# Altium schematic sheet FPGA.SCHDOC: FPGA Connections
size A2; Organization: Altium Limited.; Address1: Level 3, 12a Rodborough Rd; Address2: Frenchs Forest 2086; Address3: NSW; Address4: AUSTRALIA; DocumentNumber: 3; SheetNumber: 4; SheetTotal: 23; PageSetup: Record=PageOptions|CenterHorizontal=True|CenterVertical=True|PrintScale=0.71|XCorrection=1.00|YCorrection=1.00|PrintKind=0|BorderSize=5000000|LeftOffset=0|BottomOffset=0|Orientation=2|PaperLength=4199|PaperWidth=2969|Scale=100|PaperSource=7|PrintQuality=600|MediaType=1|DitherType=10|PaperKind=A3 (297 x 420 mm)|PrintScaleMode=1
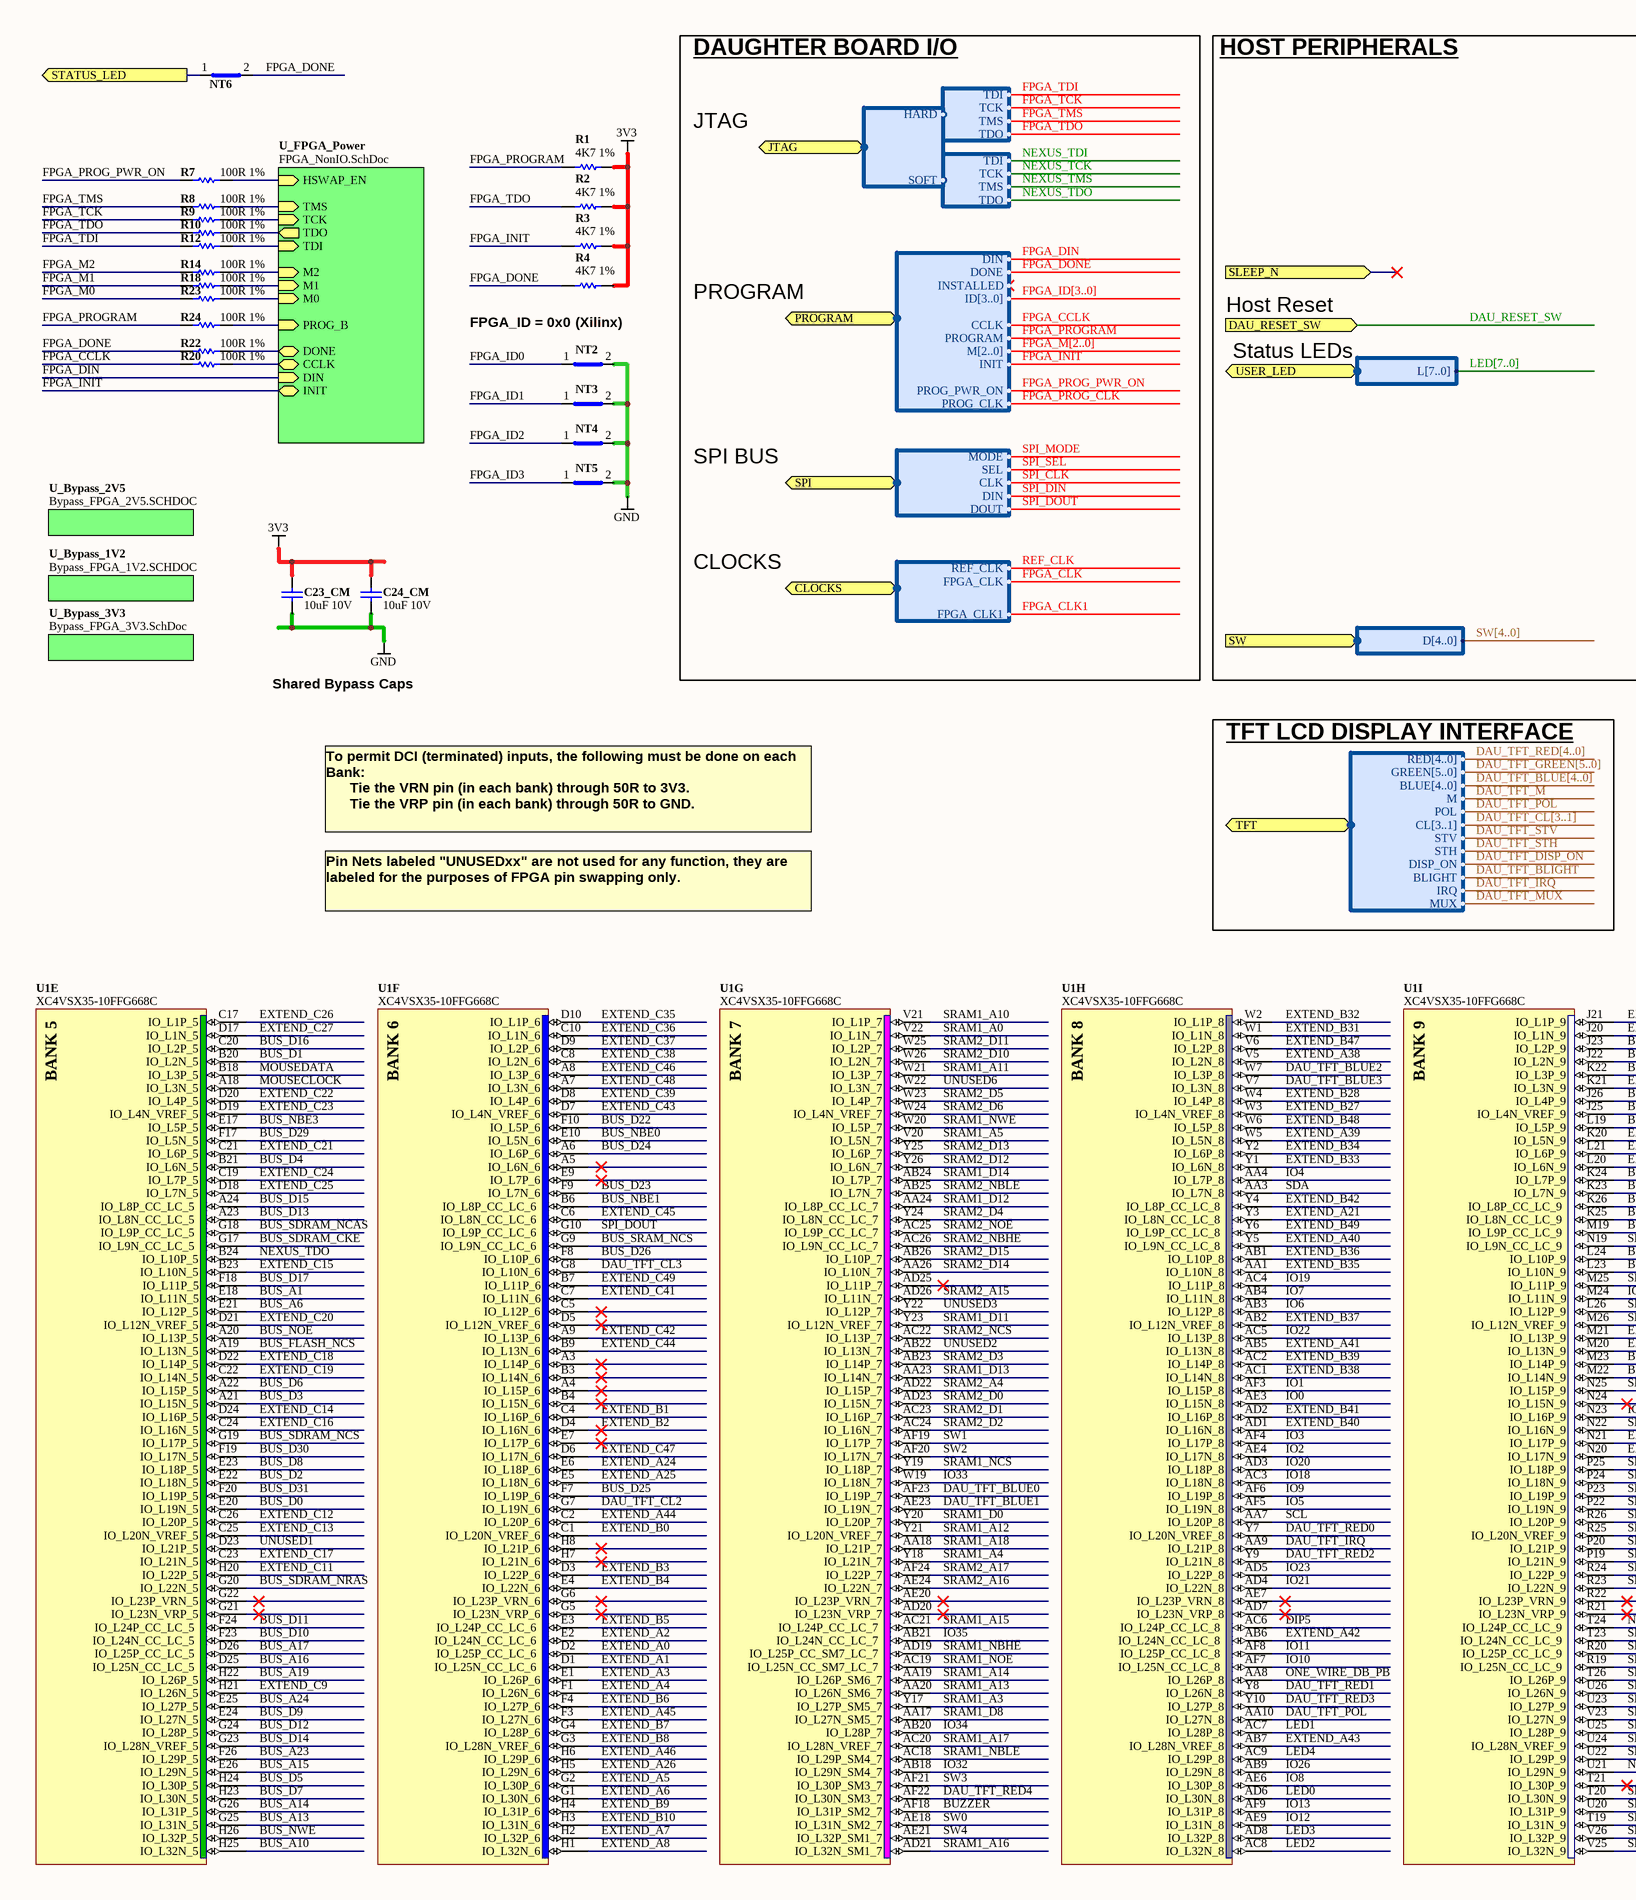
[diagram p0: FPGA.SCHDOC, left]
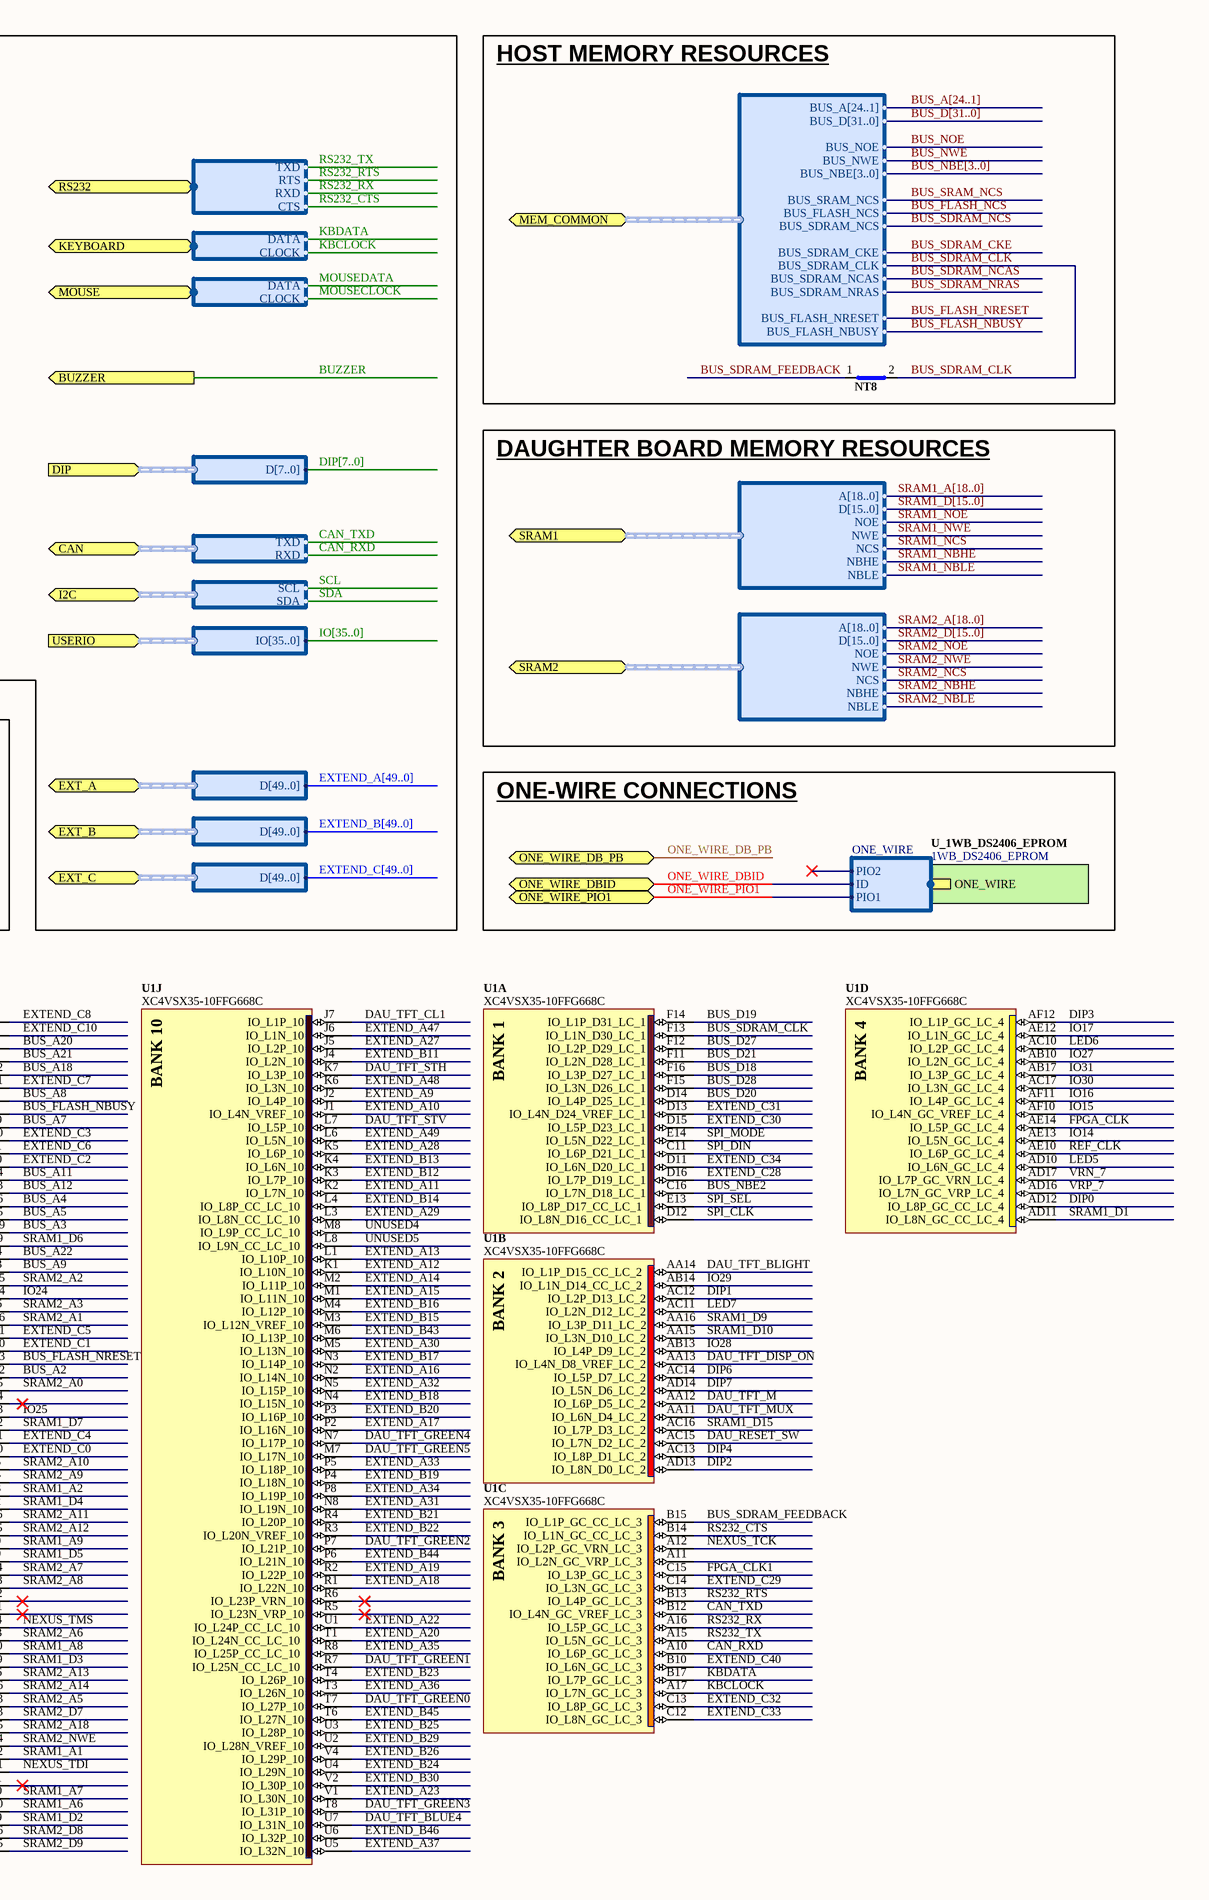
[diagram p1: FPGA.SCHDOC, right]

## Parts
C23_CM  10uF 10V  [CAPC2012-STAR]
C24_CM  10uF 10V  [CAPC2012-STAR]
NT2  Net Tie SMT2  [NETTIE-SMT2-8X8]  (value not drawn)  (net tie, no BOM)
NT3  Net Tie SMT2  [NETTIE-SMT2-8X8]  (value not drawn)  (net tie, no BOM)
NT4  Net Tie SMT2  [NETTIE-SMT2-8X8]  (value not drawn)  (net tie, no BOM)
NT5  Net Tie SMT2  [NETTIE-SMT2-8X8]  (value not drawn)  (net tie, no BOM)
NT6  Net Tie SMT2  [NETTIE-SMT2-8X8]  (value not drawn)  (net tie, no BOM)
NT8  Net Tie SMT2  [NETTIE-SMT2-8X8]  (value not drawn)  (net tie, no BOM)
R1  4K7 1%  [RESC1005-STAR]
R2  4K7 1%  [RESC1005-STAR]
R3  4K7 1%  [RESC1005-STAR]
R4  4K7 1%  [RESC1005-STAR]
R7  100R 1%  [RESC1005-STAR]
R8  100R 1%  [RESC1005-STAR]
R9  100R 1%  [RESC1005-STAR]
R10  100R 1%  [RESC1005-STAR]
R12  100R 1%  [RESC1005-STAR]
R14  100R 1%  [RESC1005-STAR]
R18  100R 1%  [RESC1005-STAR]
R20  100R 1%  [RESC1005-STAR]
R22  100R 1%  [RESC1005-STAR]
R23  100R 1%  [RESC1005-STAR]
R24  100R 1%  [RESC1005-STAR]
U1  XC4VSX35-10FFG668C  [XC4VLX25-10FF668C]  (parts A,B,C,D,E,F,G,H,I,J of 14)

## Blocks framed on the sheet
HOST MEMORY RESOURCES: NT8

## Sub-sheets
U_1WB_DS2406_EPROM = 1WB_DS2406_EPROM: ONE_WIRE (harness ONE_WIRE)
U_Bypass_1V2 = Bypass_FPGA_1V2.SCHDOC: no entries
U_Bypass_2V5 = Bypass_FPGA_2V5.SCHDOC: no entries
U_Bypass_3V3 = Bypass_FPGA_3V3.SchDoc: no entries
U_FPGA_Power = FPGA_NonIO.SchDoc: TMS (in), DONE (bidir), M1 (in), CCLK (bidir), M0 (in), M2 (in), TCK (in), HSWAP_EN (in), TDI (in), PROG_B (in), TDO (out), DIN (in), INIT (bidir)

## Ports
BUZZER (out), CAN (harness CAN_INT), CLOCKS (harness DAU_CLK), DAU_RESET_SW (in), DIP (harness SW8), EXT_A (harness PBIO), EXT_B (harness PBIO), EXT_C (harness PBIO), I2C (harness I2C), JTAG (harness HARDSOFT_JTAG), KEYBOARD (harness PS2), MEM_COMMON (harness HOSTMEMORY), MOUSE (harness PS2), ONE_WIRE_DB_PB (bidir), ONE_WIRE_DBID (bidir), ONE_WIRE_PIO1 (bidir), PROGRAM (harness DAU_CTRL), RS232 (harness RS232_INT), SLEEP_N (in), SPI (harness DAU_SPI), SRAM1 (harness SRAM-256Kx16), SRAM2 (harness SRAM-256Kx16), STATUS_LED (out), SW (harness SW5), TFT (harness DAU_TFT), USER_LED (harness LED8), USERIO (harness IO36)

## Harnesses
ONE_WIRE: ID, PIO1, PIO2
SRAM-256Kx16: A[18..0], D[15..0], NCS, NWE, NOE, NBHE, NBLE
HOSTMEMORY: BUS_A[24..1], BUS_D[31..0], BUS_NOE, BUS_NWE, BUS_NBE[3..0], BUS_SRAM_NCS, BUS_FLASH_NCS, BUS_SDRAM_NCS, BUS_SDRAM_CKE, BUS_SDRAM_CLK, BUS_SDRAM_NCAS, BUS_SDRAM_NRAS, BUS_FLASH_NRESET, BUS_FLASH_NBUSY
DAU_CLK: REF_CLK, FPGA_CLK, FPGA_CLK1
DAU_SPI: MODE, SEL, CLK, DIN, DOUT
DAU_CTRL: DIN, DONE, INSTALLED, ID[3..0], CCLK, PROGRAM, M[2..0], INIT, PROG_PWR_ON, PROG_CLK
JTAG: TMS, TDO, TDI, TCK
HARDSOFT_JTAG: HARD, SOFT
LED8: L[7..0]
SW5: D[4..0]
DAU_TFT: RED[4..0], GREEN[5..0], BLUE[4..0], M, POL, CL[3..1], STV, STH, DISP_ON, BLIGHT, IRQ, MUX
PS2: DATA, CLOCK
RS232_INT: RXD, TXD, RTS, CTS
IO36: IO[35..0]
SW8: D[7..0]
CAN_INT: TXD, RXD
I2C: SCL, SDA
PBIO: D[49..0]

## Nets
3V3: C23_CM.1 C24_CM.1 R1.2 R2.2 R3.2 R4.2
GND: C23_CM.2 C24_CM.2 NT2.2(Net2) NT3.2(Net2) NT4.2(Net2) NT5.2(Net2)
BUS_A1: U1.E18(IO_L11N_5)
BUS_A2: U1.M22(IO_L14N_9)
BUS_A3: U1.M19(IO_L9P_CC_LC_9)
BUS_A4: U1.K26(IO_L8P_CC_LC_9)
BUS_A5: U1.K25(IO_L8N_CC_LC_9)
BUS_A6: U1.E21(IO_L12P_5)
BUS_A7: U1.L19(IO_L5P_9)
BUS_A8: U1.J26(IO_L4P_9)
BUS_A9: U1.L23(IO_L10N_9)
BUS_A10: U1.H25(IO_L32N_5)
BUS_A11: U1.K24(IO_L7P_9)
BUS_A12: U1.K23(IO_L7N_9)
BUS_A13: U1.G25(IO_L31N_5)
BUS_A14: U1.G26(IO_L31P_5)
BUS_A15: U1.E26(IO_L29N_5)
BUS_A16: U1.D25(IO_L25N_CC_LC_5)
BUS_A17: U1.D26(IO_L25P_CC_LC_5)
BUS_A18: U1.K22(IO_L3P_9)
BUS_A19: U1.H22(IO_L26P_5)
BUS_A20: U1.J23(IO_L2P_9)
BUS_A21: U1.J22(IO_L2N_9)
BUS_A22: U1.L24(IO_L10P_9)
BUS_A23: U1.F26(IO_L29P_5)
BUS_A24: U1.E25(IO_L27P_5)
BUS_D0: U1.E20(IO_L19N_5)
BUS_D1: U1.B20(IO_L2N_5)
BUS_D2: U1.E22(IO_L18N_5)
BUS_D3: U1.A21(IO_L15N_5)
BUS_D4: U1.B21(IO_L6N_5)
BUS_D5: U1.H24(IO_L30P_5)
BUS_D6: U1.A22(IO_L15P_5)
BUS_D7: U1.H23(IO_L30N_5)
BUS_D8: U1.E23(IO_L18P_5)
BUS_D9: U1.E24(IO_L27N_5)
BUS_D10: U1.F23(IO_L24N_CC_LC_5)
BUS_D11: U1.F24(IO_L24P_CC_LC_5)
BUS_D12: U1.G24(IO_L28P_5)
BUS_D13: U1.A23(IO_L8N_CC_LC_5)
BUS_D14: U1.G23(IO_L28N_VREF_5)
BUS_D15: U1.A24(IO_L8P_CC_LC_5)
BUS_D16: U1.C20(IO_L2P_5)
BUS_D17: U1.F18(IO_L11P_5)
BUS_D18: U1.F16(IO_L3P_D27_LC_1)
BUS_D19: U1.F14(IO_L1P_D31_LC_1)
BUS_D20: U1.D14(IO_L4P_D25_LC_1)
BUS_D21: U1.F11(IO_L2N_D28_LC_1)
BUS_D22: U1.F10(IO_L5P_6)
BUS_D23: U1.F9(IO_L7N_6)
BUS_D24: U1.A6(IO_L6P_6)
BUS_D25: U1.F7(IO_L19P_6)
BUS_D26: U1.F8(IO_L10P_6)
BUS_D27: U1.F12(IO_L2P_D29_LC_1)
BUS_D28: U1.F15(IO_L3N_D26_LC_1)
BUS_D29: U1.F17(IO_L5N_5)
BUS_D30: U1.F19(IO_L17N_5)
BUS_D31: U1.F20(IO_L19P_5)
BUS_FLASH_NBUSY: U1.J25(IO_L4N_VREF_9) ; port MEM_COMMON.BUS_FLASH_NBUSY
BUS_FLASH_NCS: U1.A19(IO_L13N_5) ; port MEM_COMMON.BUS_FLASH_NCS
BUS_FLASH_NRESET: U1.M23(IO_L14P_9) ; port MEM_COMMON.BUS_FLASH_NRESET
BUS_NBE0: U1.E10(IO_L5N_6)
BUS_NBE1: U1.B6(IO_L8P_CC_LC_6)
BUS_NBE2: U1.C16(IO_L7N_D18_LC_1)
BUS_NBE3: U1.E17(IO_L5P_5)
BUS_NOE: U1.A20(IO_L13P_5) ; port MEM_COMMON.BUS_NOE
BUS_NWE: U1.H26(IO_L32P_5) ; port MEM_COMMON.BUS_NWE
BUS_SDRAM_CKE: U1.G17(IO_L9N_CC_LC_5) ; port MEM_COMMON.BUS_SDRAM_CKE
BUS_SDRAM_CLK: NT8.2(Net2) U1.F13(IO_L1N_D30_LC_1) ; port MEM_COMMON.BUS_SDRAM_CLK
BUS_SDRAM_FEEDBACK: NT8.1(Net1) U1.B15(IO_L1P_GC_CC_LC_3)
BUS_SDRAM_NCAS: U1.G18(IO_L9P_CC_LC_5) ; port MEM_COMMON.BUS_SDRAM_NCAS
BUS_SDRAM_NCS: U1.G19(IO_L17P_5) ; port MEM_COMMON.BUS_SDRAM_NCS
BUS_SDRAM_NRAS: U1.G20(IO_L22N_5) ; port MEM_COMMON.BUS_SDRAM_NRAS
BUS_SRAM_NCS: U1.G9(IO_L9N_CC_LC_6) ; port MEM_COMMON.BUS_SRAM_NCS
BUZZER: U1.AF18(IO_L31P_SM2_7) ; port BUZZER
CAN_RXD: U1.A10(IO_L6P_GC_LC_3) ; port CAN.RXD
CAN_TXD: U1.B12(IO_L4N_GC_VREF_LC_3) ; port CAN.TXD
DAU_RESET_SW: U1.AC15(IO_L7N_D2_LC_2) ; port DAU_RESET_SW
DAU_TFT_BLIGHT: U1.AA14(IO_L1P_D15_CC_LC_2) ; port TFT.BLIGHT
DAU_TFT_BLUE0: U1.AF23(IO_L19P_7)
DAU_TFT_BLUE1: U1.AE23(IO_L19N_7)
DAU_TFT_BLUE2: U1.W7(IO_L3P_8)
DAU_TFT_BLUE3: U1.V7(IO_L3N_8)
DAU_TFT_BLUE4: U1.U7(IO_L31N_10)
DAU_TFT_CL1: U1.J7(IO_L1P_10)
DAU_TFT_CL2: U1.G7(IO_L19N_6)
DAU_TFT_CL3: U1.G8(IO_L10N_6)
DAU_TFT_DISP_ON: U1.AA13(IO_L4N_D8_VREF_LC_2) ; port TFT.DISP_ON
DAU_TFT_GREEN0: U1.T7(IO_L27P_10)
DAU_TFT_GREEN1: U1.R7(IO_L25N_CC_LC_10)
DAU_TFT_GREEN2: U1.P7(IO_L21P_10)
DAU_TFT_GREEN3: U1.T8(IO_L31P_10)
DAU_TFT_GREEN4: U1.N7(IO_L17P_10)
DAU_TFT_GREEN5: U1.M7(IO_L17N_10)
DAU_TFT_IRQ: U1.AA9(IO_L21P_8) ; port TFT.IRQ
DAU_TFT_M: U1.AA12(IO_L6P_D5_LC_2) ; port TFT.M
DAU_TFT_MUX: U1.AA11(IO_L6N_D4_LC_2) ; port TFT.MUX
DAU_TFT_POL: U1.AA10(IO_L27N_8) ; port TFT.POL
DAU_TFT_RED0: U1.Y7(IO_L20N_VREF_8)
DAU_TFT_RED1: U1.Y8(IO_L26N_8)
DAU_TFT_RED2: U1.Y9(IO_L21N_8)
DAU_TFT_RED3: U1.Y10(IO_L27P_8)
DAU_TFT_RED4: U1.AF22(IO_L30N_SM3_7)
DAU_TFT_STH: U1.K7(IO_L3P_10) ; port TFT.STH
DAU_TFT_STV: U1.L7(IO_L5P_10) ; port TFT.STV
DIP0: U1.AD12(IO_L8P_GC_CC_LC_4)
DIP1: U1.AC12(IO_L2P_D13_LC_2)
DIP2: U1.AD13(IO_L8N_D0_LC_2)
DIP3: U1.AF12(IO_L1P_GC_LC_4)
DIP4: U1.AC13(IO_L8P_D1_LC_2)
DIP5: U1.AC6(IO_L24P_CC_LC_8)
DIP6: U1.AC14(IO_L5P_D7_LC_2)
DIP7: U1.AD14(IO_L5N_D6_LC_2)
EXTEND_A0: U1.D2(IO_L25P_CC_LC_6)
EXTEND_A1: U1.D1(IO_L25N_CC_LC_6)
EXTEND_A2: U1.E2(IO_L24N_CC_LC_6)
EXTEND_A3: U1.E1(IO_L26P_6)
EXTEND_A4: U1.F1(IO_L26N_6)
EXTEND_A5: U1.G2(IO_L30P_6)
EXTEND_A6: U1.G1(IO_L30N_6)
EXTEND_A7: U1.H2(IO_L32P_6)
EXTEND_A8: U1.H1(IO_L32N_6)
EXTEND_A9: U1.J2(IO_L4P_10)
EXTEND_A10: U1.J1(IO_L4N_VREF_10)
EXTEND_A11: U1.K2(IO_L7N_10)
EXTEND_A12: U1.K1(IO_L10N_10)
EXTEND_A13: U1.L1(IO_L10P_10)
EXTEND_A14: U1.M2(IO_L11P_10)
EXTEND_A15: U1.M1(IO_L11N_10)
EXTEND_A16: U1.N2(IO_L14N_10)
EXTEND_A17: U1.P2(IO_L16N_10)
EXTEND_A18: U1.R1(IO_L22N_10)
EXTEND_A19: U1.R2(IO_L22P_10)
EXTEND_A20: U1.T1(IO_L24N_CC_LC_10)
EXTEND_A21: U1.Y3(IO_L8N_CC_LC_8)
EXTEND_A22: U1.U1(IO_L24P_CC_LC_10)
EXTEND_A23: U1.V1(IO_L30N_10)
EXTEND_A24: U1.E6(IO_L18P_6)
EXTEND_A25: U1.E5(IO_L18N_6)
EXTEND_A26: U1.H5(IO_L29N_6)
EXTEND_A27: U1.J5(IO_L2P_10)
EXTEND_A28: U1.K5(IO_L6P_10)
EXTEND_A29: U1.L3(IO_L8N_CC_LC_10)
EXTEND_A30: U1.M5(IO_L13N_10)
EXTEND_A31: U1.N8(IO_L19N_10)
EXTEND_A32: U1.N5(IO_L15P_10)
EXTEND_A33: U1.P5(IO_L18P_10)
EXTEND_A34: U1.P8(IO_L19P_10)
EXTEND_A35: U1.R8(IO_L25P_CC_LC_10)
EXTEND_A36: U1.T3(IO_L26N_10)
EXTEND_A37: U1.U5(IO_L32N_10)
EXTEND_A38: U1.V5(IO_L2N_8)
EXTEND_A39: U1.W5(IO_L5N_8)
EXTEND_A40: U1.Y5(IO_L9N_CC_LC_8)
EXTEND_A41: U1.AB5(IO_L13N_8)
EXTEND_A42: U1.AB6(IO_L24N_CC_LC_8)
EXTEND_A43: U1.AB7(IO_L28N_VREF_8)
EXTEND_A44: U1.C2(IO_L20P_6)
EXTEND_A45: U1.F3(IO_L27N_6)
EXTEND_A46: U1.H6(IO_L29P_6)
EXTEND_A47: U1.J6(IO_L1N_10)
EXTEND_A48: U1.K6(IO_L3N_10)
EXTEND_A49: U1.L6(IO_L5N_10)
EXTEND_B0: U1.C1(IO_L20N_VREF_6)
EXTEND_B1: U1.C4(IO_L16P_6)
EXTEND_B2: U1.D4(IO_L16N_6)
EXTEND_B3: U1.D3(IO_L22P_6)
EXTEND_B4: U1.E4(IO_L22N_6)
EXTEND_B5: U1.E3(IO_L24P_CC_LC_6)
EXTEND_B6: U1.F4(IO_L27P_6)
EXTEND_B7: U1.G4(IO_L28P_6)
EXTEND_B8: U1.G3(IO_L28N_VREF_6)
EXTEND_B9: U1.H4(IO_L31P_6)
EXTEND_B10: U1.H3(IO_L31N_6)
EXTEND_B11: U1.J4(IO_L2N_10)
EXTEND_B12: U1.K3(IO_L7P_10)
EXTEND_B13: U1.K4(IO_L6N_10)
EXTEND_B14: U1.L4(IO_L8P_CC_LC_10)
EXTEND_B15: U1.M3(IO_L12N_VREF_10)
EXTEND_B16: U1.M4(IO_L12P_10)
EXTEND_B17: U1.N3(IO_L14P_10)
EXTEND_B18: U1.N4(IO_L15N_10)
EXTEND_B19: U1.P4(IO_L18N_10)
EXTEND_B20: U1.P3(IO_L16P_10)
EXTEND_B21: U1.R4(IO_L20P_10)
EXTEND_B22: U1.R3(IO_L20N_VREF_10)
EXTEND_B23: U1.T4(IO_L26P_10)
EXTEND_B24: U1.U4(IO_L29N_10)
EXTEND_B25: U1.U3(IO_L28P_10)
EXTEND_B26: U1.V4(IO_L29P_10)
EXTEND_B27: U1.W3(IO_L4N_VREF_8)
EXTEND_B28: U1.W4(IO_L4P_8)
EXTEND_B29: U1.U2(IO_L28N_VREF_10)
EXTEND_B30: U1.V2(IO_L30P_10)
EXTEND_B31: U1.W1(IO_L1N_8)
EXTEND_B32: U1.W2(IO_L1P_8)
EXTEND_B33: U1.Y1(IO_L6N_8)
EXTEND_B34: U1.Y2(IO_L6P_8)
EXTEND_B35: U1.AA1(IO_L10N_8)
EXTEND_B36: U1.AB1(IO_L10P_8)
EXTEND_B37: U1.AB2(IO_L12N_VREF_8)
EXTEND_B38: U1.AC1(IO_L14N_8)
EXTEND_B39: U1.AC2(IO_L14P_8)
EXTEND_B40: U1.AD1(IO_L16N_8)
EXTEND_B41: U1.AD2(IO_L16P_8)
EXTEND_B42: U1.Y4(IO_L8P_CC_LC_8)
EXTEND_B43: U1.M6(IO_L13P_10)
EXTEND_B44: U1.P6(IO_L21N_10)
EXTEND_B45: U1.T6(IO_L27N_10)
EXTEND_B46: U1.U6(IO_L32P_10)
EXTEND_B47: U1.V6(IO_L2P_8)
EXTEND_B48: U1.W6(IO_L5P_8)
EXTEND_B49: U1.Y6(IO_L9P_CC_LC_8)
EXTEND_C0: U1.N20(IO_L17N_9)
EXTEND_C1: U1.M20(IO_L13N_9)
EXTEND_C2: U1.L20(IO_L6N_9)
EXTEND_C3: U1.K20(IO_L5N_9)
EXTEND_C4: U1.N21(IO_L17P_9)
EXTEND_C5: U1.M21(IO_L13P_9)
EXTEND_C6: U1.L21(IO_L6P_9)
EXTEND_C7: U1.K21(IO_L3N_9)
EXTEND_C8: U1.J21(IO_L1P_9)
EXTEND_C9: U1.H21(IO_L26N_5)
EXTEND_C10: U1.J20(IO_L1N_9)
EXTEND_C11: U1.H20(IO_L22P_5)
EXTEND_C12: U1.C26(IO_L20P_5)
EXTEND_C13: U1.C25(IO_L20N_VREF_5)
EXTEND_C14: U1.D24(IO_L16P_5)
EXTEND_C15: U1.B23(IO_L10N_5)
EXTEND_C16: U1.C24(IO_L16N_5)
EXTEND_C17: U1.C23(IO_L21N_5)
EXTEND_C18: U1.D22(IO_L14P_5)
EXTEND_C19: U1.C22(IO_L14N_5)
EXTEND_C20: U1.D21(IO_L12N_VREF_5)
EXTEND_C21: U1.C21(IO_L6P_5)
EXTEND_C22: U1.D20(IO_L4P_5)
EXTEND_C23: U1.D19(IO_L4N_VREF_5)
EXTEND_C24: U1.C19(IO_L7P_5)
EXTEND_C25: U1.D18(IO_L7N_5)
EXTEND_C26: U1.C17(IO_L1P_5)
EXTEND_C27: U1.D17(IO_L1N_5)
EXTEND_C28: U1.D16(IO_L7P_D19_LC_1)
EXTEND_C29: U1.C14(IO_L3N_GC_LC_3)
EXTEND_C30: U1.D15(IO_L5P_D23_LC_1)
EXTEND_C31: U1.D13(IO_L4N_D24_VREF_LC_1)
EXTEND_C32: U1.C13(IO_L8P_GC_LC_3)
EXTEND_C33: U1.C12(IO_L8N_GC_LC_3)
EXTEND_C34: U1.D11(IO_L6N_D20_LC_1)
EXTEND_C35: U1.D10(IO_L1P_6)
EXTEND_C36: U1.C10(IO_L1N_6)
EXTEND_C37: U1.D9(IO_L2P_6)
EXTEND_C38: U1.C8(IO_L2N_6)
EXTEND_C39: U1.D8(IO_L4P_6)
EXTEND_C40: U1.B10(IO_L6N_GC_LC_3)
EXTEND_C41: U1.C7(IO_L11N_6)
EXTEND_C42: U1.A9(IO_L13P_6)
EXTEND_C43: U1.D7(IO_L4N_VREF_6)
EXTEND_C44: U1.B9(IO_L13N_6)
EXTEND_C45: U1.C6(IO_L8N_CC_LC_6)
EXTEND_C46: U1.A8(IO_L3P_6)
EXTEND_C47: U1.D6(IO_L17N_6)
EXTEND_C48: U1.A7(IO_L3N_6)
EXTEND_C49: U1.B7(IO_L11P_6)
FPGA_CCLK: R20.1 ; port PROGRAM.CCLK
FPGA_CLK: U1.AE14(IO_L5P_GC_LC_4) ; port CLOCKS.FPGA_CLK
FPGA_CLK1: U1.C15(IO_L3P_GC_LC_3) ; port CLOCKS.FPGA_CLK1
FPGA_DIN: sheet U_FPGA_Power/DIN, port PROGRAM.DIN
FPGA_DONE: NT6.2(Net2) R4.1 R22.1 ; port PROGRAM.DONE
FPGA_ID0: NT2.1(Net1)
FPGA_ID1: NT3.1(Net1)
FPGA_ID2: NT4.1(Net1)
FPGA_ID3: NT5.1(Net1)
FPGA_INIT: R3.1 ; sheet U_FPGA_Power/INIT, port PROGRAM.INIT
FPGA_M0: R23.1
FPGA_M1: R18.1
FPGA_M2: R14.1
FPGA_PROG_CLK: port PROGRAM.PROG_CLK
FPGA_PROG_PWR_ON: R7.1 ; port PROGRAM.PROG_PWR_ON
FPGA_PROGRAM: R1.1 R24.1 ; port PROGRAM.PROGRAM
FPGA_TCK: R9.1 ; harness JTAG.TCK
FPGA_TDI: R12.1 ; harness JTAG.TDI
FPGA_TDO: R2.1 R10.1 ; harness JTAG.TDO
FPGA_TMS: R8.1 ; harness JTAG.TMS
IO0: U1.AE3(IO_L15N_8)
IO1: U1.AF3(IO_L15P_8)
IO2: U1.AE4(IO_L17N_8)
IO3: U1.AF4(IO_L17P_8)
IO4: U1.AA4(IO_L7P_8)
IO5: U1.AF5(IO_L19N_8)
IO6: U1.AB3(IO_L12P_8)
IO7: U1.AB4(IO_L11N_8)
IO8: U1.AE6(IO_L30P_8)
IO9: U1.AF6(IO_L19P_8)
IO10: U1.AF7(IO_L25N_CC_LC_8)
IO11: U1.AF8(IO_L25P_CC_LC_8)
IO12: U1.AE9(IO_L31N_8)
IO13: U1.AF9(IO_L31P_8)
IO14: U1.AE13(IO_L5N_GC_LC_4)
IO15: U1.AF10(IO_L4N_GC_VREF_LC_4)
IO16: U1.AF11(IO_L4P_GC_LC_4)
IO17: U1.AE12(IO_L1N_GC_LC_4)
IO18: U1.AC3(IO_L18N_8)
IO19: U1.AC4(IO_L11P_8)
IO20: U1.AD3(IO_L18P_8)
IO21: U1.AD4(IO_L22N_8)
IO22: U1.AC5(IO_L13P_8)
IO23: U1.AD5(IO_L22P_8)
IO24: U1.M24(IO_L11N_9)
IO25: U1.N23(IO_L16P_9)
IO26: U1.AB9(IO_L29N_8)
IO27: U1.AB10(IO_L2N_GC_LC_4)
IO28: U1.AB13(IO_L4P_D9_LC_2)
IO29: U1.AB14(IO_L1N_D14_CC_LC_2)
IO30: U1.AC17(IO_L3N_GC_LC_4)
IO31: U1.AB17(IO_L3P_GC_LC_4)
IO32: U1.AB18(IO_L29N_SM4_7)
IO33: U1.W19(IO_L18N_7)
IO34: U1.AB20(IO_L28P_7)
IO35: U1.AB21(IO_L24N_CC_LC_7)
KBCLOCK: U1.A17(IO_L7N_GC_LC_3) ; port KEYBOARD.CLOCK
KBDATA: U1.B17(IO_L7P_GC_LC_3) ; port KEYBOARD.DATA
LED0: U1.AD6(IO_L30N_8)
LED1: U1.AC7(IO_L28P_8)
LED2: U1.AC8(IO_L32N_8)
LED3: U1.AD8(IO_L32P_8)
LED4: U1.AC9(IO_L29P_8)
LED5: U1.AD10(IO_L6N_GC_LC_4)
LED6: U1.AC10(IO_L2P_GC_LC_4)
LED7: U1.AC11(IO_L2N_D12_LC_2)
MOUSECLOCK: U1.A18(IO_L3N_5) ; port MOUSE.CLOCK
MOUSEDATA: U1.B18(IO_L3P_5) ; port MOUSE.DATA
NEXUS_TCK: U1.A12(IO_L2P_GC_VRN_LC_3) ; harness JTAG.TCK
NEXUS_TDI: U1.U21(IO_L29N_9) ; harness JTAG.TDI
NEXUS_TDO: U1.B24(IO_L10P_5) ; harness JTAG.TDO
NEXUS_TMS: U1.T24(IO_L24P_CC_LC_9) ; harness JTAG.TMS
ONE_WIRE_DB_PB: U1.AA8(IO_L26P_8) ; port ONE_WIRE_DB_PB
ONE_WIRE_DBID: port ONE_WIRE_DBID, sheet U_1WB_DS2406_EPROM/ONE_WIRE.ID
ONE_WIRE_PIO1: port ONE_WIRE_PIO1, sheet U_1WB_DS2406_EPROM/ONE_WIRE.PIO1
REF_CLK: U1.AE10(IO_L6P_GC_LC_4) ; port CLOCKS.REF_CLK
RS232_CTS: U1.B14(IO_L1N_GC_CC_LC_3) ; port RS232.CTS
RS232_RTS: U1.B13(IO_L4P_GC_LC_3) ; port RS232.RTS
RS232_RX: U1.A16(IO_L5P_GC_LC_3) ; port RS232.RXD
RS232_TX: U1.A15(IO_L5N_GC_LC_3) ; port RS232.TXD
SCL: U1.AA7(IO_L20P_8) ; port I2C.SCL
SDA: U1.AA3(IO_L7N_8) ; port I2C.SDA
SPI_CLK: U1.D12(IO_L8N_D16_CC_LC_1) ; port SPI.CLK
SPI_DIN: U1.C11(IO_L6P_D21_LC_1) ; port SPI.DIN
SPI_DOUT: U1.G10(IO_L9P_CC_LC_6) ; port SPI.DOUT
SPI_MODE: U1.E14(IO_L5N_D22_LC_1) ; port SPI.MODE
SPI_SEL: U1.E13(IO_L8P_D17_CC_LC_1) ; port SPI.SEL
SRAM1_A0: U1.V22(IO_L1N_7)
SRAM1_A1: U1.U22(IO_L29P_9)
SRAM1_A2: U1.P23(IO_L19P_9)
SRAM1_A3: U1.Y17(IO_L27P_SM5_7)
SRAM1_A4: U1.Y18(IO_L21N_7)
SRAM1_A5: U1.V20(IO_L5N_7)
SRAM1_A6: U1.U20(IO_L31P_9)
SRAM1_A7: U1.T20(IO_L30N_9)
SRAM1_A8: U1.R20(IO_L25P_CC_LC_9)
SRAM1_A9: U1.P20(IO_L21P_9)
SRAM1_A10: U1.V21(IO_L1P_7)
SRAM1_A11: U1.W21(IO_L3P_7)
SRAM1_A12: U1.Y21(IO_L20N_VREF_7)
SRAM1_A13: U1.AA20(IO_L26N_SM6_7)
SRAM1_A14: U1.AA19(IO_L26P_SM6_7)
SRAM1_A15: U1.AC21(IO_L24P_CC_LC_7)
SRAM1_A16: U1.AD21(IO_L32N_SM1_7)
SRAM1_A17: U1.AC20(IO_L28N_VREF_7)
SRAM1_A18: U1.AA18(IO_L21P_7)
SRAM1_D0: U1.Y20(IO_L20P_7)
SRAM1_D1: U1.AD11(IO_L8N_GC_CC_LC_4)
SRAM1_D2: U1.T19(IO_L31N_9)
SRAM1_D3: U1.R19(IO_L25N_CC_LC_9)
SRAM1_D4: U1.P22(IO_L19N_9)
SRAM1_D5: U1.P19(IO_L21N_9)
SRAM1_D6: U1.N19(IO_L9N_CC_LC_9)
SRAM1_D7: U1.N22(IO_L16N_9)
SRAM1_D8: U1.AA17(IO_L27N_SM5_7)
SRAM1_D9: U1.AA16(IO_L3P_D11_LC_2)
SRAM1_D10: U1.AA15(IO_L3N_D10_LC_2)
SRAM1_D11: U1.Y23(IO_L12N_VREF_7)
SRAM1_D12: U1.AA24(IO_L8P_CC_LC_7)
SRAM1_D13: U1.AA23(IO_L14N_7)
SRAM1_D14: U1.AB24(IO_L7P_7)
SRAM1_D15: U1.AC16(IO_L7P_D3_LC_2)
SRAM1_NBHE: U1.AD19(IO_L25P_CC_SM7_LC_7) ; port SRAM1.NBHE
SRAM1_NBLE: U1.AC18(IO_L29P_SM4_7) ; port SRAM1.NBLE
SRAM1_NCS: U1.Y19(IO_L18P_7) ; port SRAM1.NCS
SRAM1_NOE: U1.AC19(IO_L25N_CC_SM7_LC_7) ; port SRAM1.NOE
SRAM1_NWE: U1.W20(IO_L5P_7) ; port SRAM1.NWE
SRAM2_A0: U1.N25(IO_L15P_9)
SRAM2_A1: U1.M26(IO_L12N_VREF_9)
SRAM2_A2: U1.M25(IO_L11P_9)
SRAM2_A3: U1.L26(IO_L12P_9)
SRAM2_A4: U1.AD22(IO_L15P_7)
SRAM2_A5: U1.U23(IO_L27P_9)
SRAM2_A6: U1.T23(IO_L24N_CC_LC_9)
SRAM2_A7: U1.R24(IO_L22P_9)
SRAM2_A8: U1.R23(IO_L22N_9)
SRAM2_A9: U1.P24(IO_L18N_9)
SRAM2_A10: U1.P25(IO_L18P_9)
SRAM2_A11: U1.R26(IO_L20P_9)
SRAM2_A12: U1.R25(IO_L20N_VREF_9)
SRAM2_A13: U1.T26(IO_L26P_9)
SRAM2_A14: U1.U26(IO_L26N_9)
SRAM2_A15: U1.AD26(IO_L11N_7)
SRAM2_A16: U1.AE24(IO_L22N_7)
SRAM2_A17: U1.AF24(IO_L22P_7)
SRAM2_A18: U1.U25(IO_L28P_9)
SRAM2_D0: U1.AD23(IO_L15N_7)
SRAM2_D1: U1.AC23(IO_L16P_7)
SRAM2_D2: U1.AC24(IO_L16N_7)
SRAM2_D3: U1.AB23(IO_L14P_7)
SRAM2_D4: U1.Y24(IO_L8N_CC_LC_7)
SRAM2_D5: U1.W23(IO_L4P_7)
SRAM2_D6: U1.W24(IO_L4N_VREF_7)
SRAM2_D7: U1.V23(IO_L27N_9)
SRAM2_D8: U1.V26(IO_L32P_9)
SRAM2_D9: U1.V25(IO_L32N_9)
SRAM2_D10: U1.W26(IO_L2N_7)
SRAM2_D11: U1.W25(IO_L2P_7)
SRAM2_D12: U1.Y26(IO_L6N_7)
SRAM2_D13: U1.Y25(IO_L6P_7)
SRAM2_D14: U1.AA26(IO_L10N_7)
SRAM2_D15: U1.AB26(IO_L10P_7)
SRAM2_NBHE: U1.AC26(IO_L9N_CC_LC_7) ; port SRAM2.NBHE
SRAM2_NBLE: U1.AB25(IO_L7N_7) ; port SRAM2.NBLE
SRAM2_NCS: U1.AC22(IO_L13P_7) ; port SRAM2.NCS
SRAM2_NOE: U1.AC25(IO_L9P_CC_LC_7) ; port SRAM2.NOE
SRAM2_NWE: U1.U24(IO_L28N_VREF_9) ; port SRAM2.NWE
STATUS_LED: NT6.1(Net1) ; port STATUS_LED
SW0: U1.AE18(IO_L31N_SM2_7)
SW1: U1.AF19(IO_L17P_7)
SW2: U1.AF20(IO_L17N_7)
SW3: U1.AF21(IO_L30P_SM3_7)
SW4: U1.AE21(IO_L32P_SM1_7)
UNUSED1: U1.D23(IO_L21P_5)
UNUSED2: U1.AB22(IO_L13N_7)
UNUSED3: U1.Y22(IO_L12P_7)
UNUSED4: U1.M8(IO_L9P_CC_LC_10)
UNUSED5: U1.L8(IO_L9N_CC_LC_10)
UNUSED6: U1.W22(IO_L3N_7)
VRN_7: U1.AD17(IO_L7P_GC_VRN_LC_4)
VRP_7: U1.AD16(IO_L7N_GC_VRP_LC_4)
NetR7_2: R7.2 ; sheet U_FPGA_Power/HSWAP_EN
NetR8_2: R8.2 ; sheet U_FPGA_Power/TMS
NetR9_2: R9.2 ; sheet U_FPGA_Power/TCK
NetR10_2: R10.2 ; sheet U_FPGA_Power/TDO
NetR12_2: R12.2 ; sheet U_FPGA_Power/TDI
NetR14_2: R14.2 ; sheet U_FPGA_Power/M2
NetR18_2: R18.2 ; sheet U_FPGA_Power/M1
NetR20_2: R20.2 ; sheet U_FPGA_Power/CCLK
NetR22_2: R22.2 ; sheet U_FPGA_Power/DONE
NetR23_2: R23.2 ; sheet U_FPGA_Power/M0
NetR24_2: R24.2 ; sheet U_FPGA_Power/PROG_B

Not connected (* = marked no-connect by the designer): U1 A3(IO_L14P_6)* A4(IO_L15P_6)* A5(IO_L6N_6)* A11(IO_L2N_GC_VRP_LC_3) AD7(IO_L23N_VRP_8)* AD20(IO_L23N_VRP_7)* AD25(IO_L11P_7)* AE7(IO_L23P_VRN_8)* AE20(IO_L23P_VRN_7)* B3(IO_L14N_6)* B4(IO_L15N_6)* C5(IO_L12P_6)* D5(IO_L12N_VREF_6)* E7(IO_L17P_6)* E9(IO_L7P_6)* G5(IO_L23N_VRP_6)* G6(IO_L23P_VRN_6)* G21(IO_L23N_VRP_5)* G22(IO_L23P_VRN_5)* H7(IO_L21N_6)* H8(IO_L21P_6)* N24(IO_L15N_9)* R5(IO_L23N_VRP_10)* R6(IO_L23P_VRN_10)* R21(IO_L23N_VRP_9)* R22(IO_L23P_VRN_9)* T21(IO_L30P_9)*

## Buses and harness runs
bus BUS_A[24..1]
bus BUS_D[31..0]
bus BUS_NBE[3..0]
bus DAU_TFT_BLUE[4..0]
bus DAU_TFT_CL[3..1]
bus DAU_TFT_GREEN[5..0]
bus DAU_TFT_RED[4..0]
bus DIP[7..0]
bus EXTEND_A[49..0]
bus EXTEND_B[49..0]
bus EXTEND_C[49..0]
bus FPGA_ID[3..0]
bus FPGA_M[2..0]
bus IO[35..0]
bus LED[7..0]
bus SRAM1_A[18..0]
bus SRAM1_D[15..0]
bus SRAM2_A[18..0]
bus SRAM2_D[15..0]
bus SW[4..0]

## Notes on the sheet
- DAUGHTER BOARD I/O
- HOST PERIPHERALS
- JTAG
- FPGA_ID = 0x0
- (Xilinx)
- PROGRAM
- Host Reset
- Status LEDs
- SPI BUS
- DAUGHTER BOARD MEMORY RESOURCES
- CLOCKS
- Shared Bypass Caps
- TFT LCD DISPLAY INTERFACE
- ONE-WIRE CONNECTIONS
- To permit DCI (terminated) inputs, the following must be done on each Bank:
  Tie the VRN pin (in each bank) through 50R to 3V3.
  Tie the VRP pin (in each bank) through 50R to GND.
- Pin Nets labeled "UNUSEDxx" are not used for any function, they are labeled for the purposes of FPGA pin swapping only.
- Project Title
- Sheet Title
- Size:
- Date:
- File:
- A2
- Assy:
- Time:
- Revision:
- Sheet
- of
- (in symbol D-241-0021, part A) BANK 1
- (in symbol D-241-0021, part B) BANK 2
- (in symbol D-241-0021, part C) BANK 3
- (in symbol D-241-0021, part D) BANK 4
- (in symbol D-241-0021, part E) BANK 5
- (in symbol D-241-0021, part F) BANK 6
- (in symbol D-241-0021, part G) BANK 7
- (in symbol D-241-0021, part H) BANK 8
- (in symbol D-241-0021, part I) BANK 9
- (in symbol D-241-0021, part J) BANK 10

## Library data of the parts
C23_CM C24_CM = D-101-0087: Capacitor, Ceramic, 10uF 10% 10V 0805 (2012) X5R; Polarity: Non-Polarized; Capacitance: 10 uF; Dielectric: X5R; Mounting Technology: Surface Mount; Rated Voltage: 10 V; Status: Unreleased; Technology: None; Tolerance: 10 %; Category: Capacitor
NT2-NT6 NT8 = D-002-0002: Net-Tie, Surface Mount, 2 x 0.4mm x 0.2mm SMT Pads - For 0.2mm Track; Status: Production; Category: Net-Tie
R1-R4 = D-100-0088: Resistor, 4K7 1% 0402 (1005); Power Rating: 63 mW; Resistance: 4.7 K; Mounting Technology: Surface Mount; Status: Production; Tolerance: 1 %; Category: Resistor
R7-R10 R12 R14 R18 R20 R22-R24 = D-100-0131: Resistor, 100R 1% 0402 (1005); Power Rating: 63 mW; Mounting Technology: Surface Mount; Resistance: 100 R; Status: Production; Tolerance: 1 %; Category: Resistor
U1 = D-241-0021: FPGA, Xilinx Virtex-4, XC4VSX35; Supply Voltage: mV; Mounting Technology: Surface Mount; Status: Production; Technology: None; Category: IC-FPGA